# Altium schematic sheet Boost-Shield-V1.5.SchDoc
size B; SheetNumber: 3; SheetTotal: 3
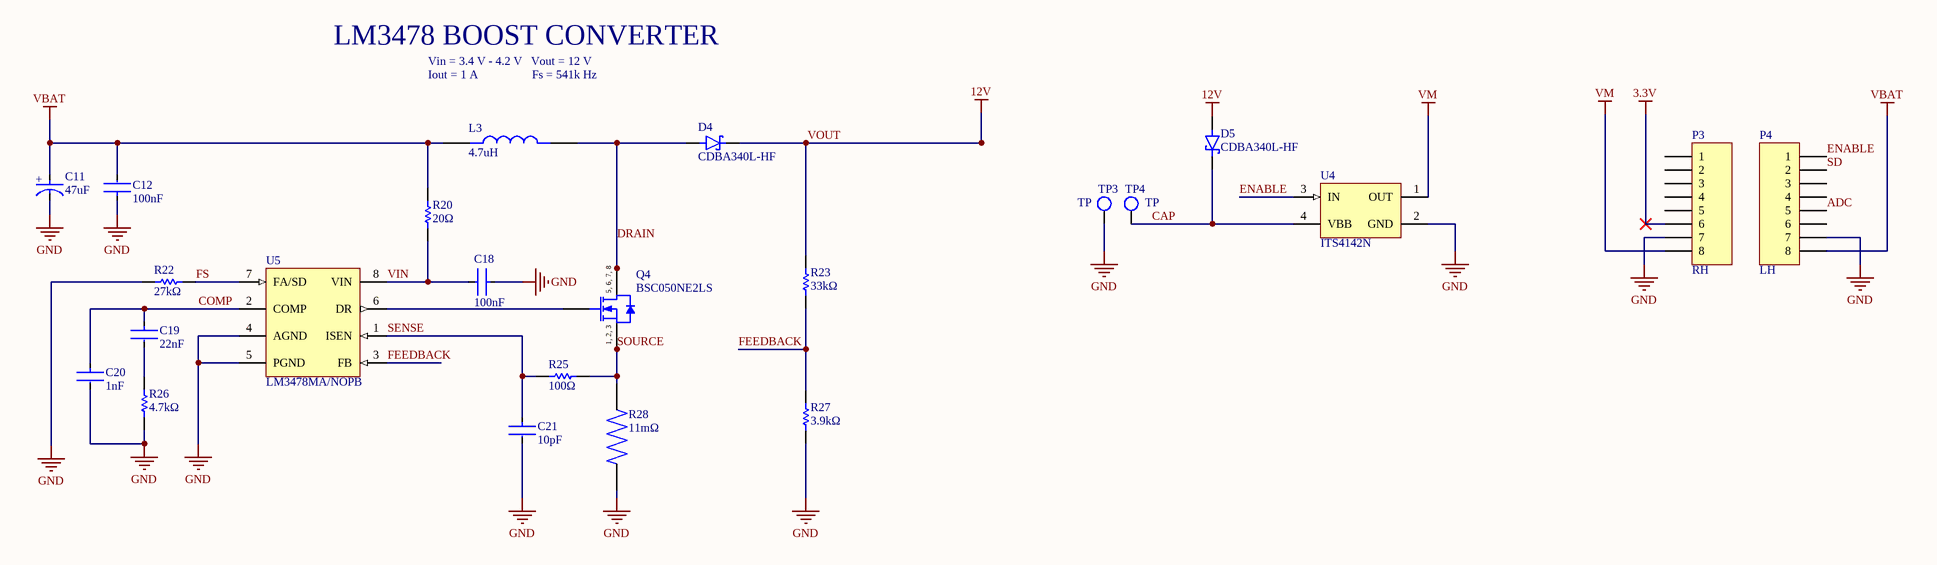
[diagram p0: Boost-Shield-V1.5.SchDoc]

## Parts
C11  47uF  [FP-F38M-MFG]
C12  100nF  [FP-CL10-IPC_C]
C18  100nF  [FP-CL10-IPC_C]
C19  22nF  [FP-CC0603-DA-MFG]
C20  1nF  [FP-0603-L_1_6_0_15-W_0_81-IPC_C]
C21  10pF  [FP-C0603C-CF-MFG]
D4  CDBA340L-HF  [DIOM5225X250N]
D5  CDBA340L-HF  [DIOM5225X250N]
L3  4.7uH  [IND_ETQP4M4R7KFN]
P3  RH  [HDR1X8]
P4  LH  [HDR1X8]
Q4  BSC050NE2LS  [INF-PG-TDSON-8-1_V]
R20  20Ω  [RESC1608X55X30ML15T15]
R22  27kΩ  [RESC1608X55X30ML15T15]
R23  33kΩ  [RESC1609X50X30LL10T20]
R25  100Ω  [RESC1609X50X30ML8T20]
R26  4.7kΩ  [RESC1608X55X30NL15T15]
R27  3.9kΩ  [RESC1608X55X30LL15T15]
R28  11mΩ  [RESC3115X65N]
TP3  TP  [TP]
TP4  TP  [TP]
U4  ITS4142N  [INF-SOT223_M]
U5  LM3478MA/NOPB  [D0008A_L]

## Nets
3.3V: P3.6
GND: C11.1(C) C12.1 C18.1 C20.2 C21.2 P3.7 P4.7 R22.1 R26.1 R27.1 R28.1 TP3.1 U4.2(GND) U5.4(AGND) U5.5(PGND)
VBAT: C11.2(A) C12.2 L3.1 P4.8 R20.2
VM: P3.8 U4.1(OUT)
VOUT: D4.C(K) D5.A R23.2  [also labelled 12V]
ADC: P4.5
CAP: D5.C(K) TP4.1 U4.4(VBB)
COMP: C19.1 C20.1 U5.2(COMP)
DRAIN: D4.A L3.2 Q4.5(DRAIN) Q4.6(DRAIN) Q4.7(DRAIN) Q4.8(DRAIN)
ENABLE: P4.1 U4.3(IN)
FEEDBACK: R23.1 R27.2 U5.3(FB)
FS: R22.2 U5.7(FA/SD)
SD: P4.2
SENSE: C21.1 R25.1 U5.1(ISEN)
SOURCE: Q4.1(SOURCE) Q4.2(SOURCE) Q4.3(SOURCE) R25.2 R28.2
VIN: C18.2 R20.1 U5.8(VIN)
NetC19_2: C19.2 R26.2
NetQ4_4: Q4.4(GATE) U5.6(DR)

Not connected (* = marked no-connect by the designer): P3 1 2 3 4 5; P4 3 4 6

## Notes on the sheet
- LM3478 BOOST CONVERTER
- Vin = 3.4 V - 4.2 V   Vout = 12 V
  Iout = 1 A                  Fs = 541k Hz
- (in symbol CMP-1090-00044-1) 5, 6, 7, 8; 1, 2, 3
- (in symbol CMP-04423-000016-1) +

## Library data of the parts
C11 = CMP-04423-000016-1: CAP TANT POLY 47UF 6.3V SMD / F380J476MMAAXEH3; Manufacturer: AVX; Dissipation Factor: 10%; Ripple Current: 289mA; Life: 1000Hours; Leakage Current: 59.2uA; Esr: 300mΩ; Material: Tantalum-Polymer; Tolerance: 20%; ComponentLink2Description: Datasheet; Device Class L2: Capacitors; Temperature Range Low: -55°C; Device Class L1: Passive Components; Voltage Rating: 6.3V; Device Class L3: Polymer Capacitors; Automotive: No; Temperature: -55°C to +105°C; Lead Free: Yes; Height: 1mm; Digikey Description: CAP TANT POLY 47UF 6.3V SMD; ComponentLink2URL: http://datasheets.avx.com/F38.pdf; Package: F38M; RoHS: TRUE; Capacitance: 47uF; Octopart: https://octopart.com/f380j476mmaaxeh3-avx-67040374; Manufacturer Part Number: F380J476MMAAXEH3; Value: 47uF; Footprint Url: http://www.avx.com/download/software/literature/AVX-Footprint-Library.pdf; Temperature Range High: +105°C; Category: Cap
C12 C18 = CMP-13271-001724-1: Cap Ceramic 100nF 50V X7R ±20% Pad SMD 0603 +125°C T/R / CL10B104MB8NNNC; Mount: Surface Mount; Lead Free: Lead Free; Max Operating Temperature: 125°C; Voltage Rating: 50V; Case Code (Imperial): 0603; Capacitance: 100nF; Height: 0.8mm; Length: 1.6mm; Tolerance: 20%; Case Code (Metric): 1608; Thickness: 0.035inch; Depth: 0.8mm; Width: 0.031inch; Package Quantity: 1; Min Operating Temperature: -55°C; Case/Package: 0603; Radiation Hardening: No; Voltage Rating (DC): 50V; Dielectric: X7R; Packaging: Tape and Reel
C19 = CMP-2100-03602-2: 0603 22 nF 50 V ±10 % Tolerance X7R SMT Multilayer Ceramic Capacitor / CC0603KRX7R9BB223; Manufacturer: YAGEO; Temperature Coefficient: 15%; Tolerance: 0.1; Voltage Rating: 50 V; Device Class L3: Ceramic Capacitors; Temperature Range Low: -55°C; RoHS: TRUE; Temperature Range High: +125°C; Category: Cap; Capacitance: 22 nF; Height: 0.9mm; Manufacturer Part Number: CC0603KRX7R9BB223; ComponentLink2Description: Datasheet; Value: 22 nF; ComponentLink2URL: http://www.yageo.com/documents/recent/UPY-GPHC_X7R_6.3V-to-50V_18.pdf; Material: Ceramic; Digikey Description: 0603 22 nF 50 V ±10 % Tolerance X7R SMT Multilayer Ceramic Capacitor; Device Class L1: Passive Components; Device Class L2: Capacitors; Temperature Characteristic: X7R; Octopart: https://octopart.com/cc0603krx7r9bb223-yageo-41224721; Automotive: No; Temperature: -55°C to +125°C; Lead Free: Yes; Package: CC0603-DA; Mouser Description: Multilayer Ceramic Capacitors MLCC - SMD/SMT 22nF 50V X7R 10%; Footprint Url: http://www.yageo.com/exep/pages/download/literatures/UPY-C_GEN_24.pdf; Voltage: 50 V
C20 = CMP-2006-02076-2: CAP CER 10000PF 50V X7R 0603 / 06035C103KAT4A; Insulation Resistance: 100GR; Tolerance: 10%; Dissipation Factor: 2.5%; Capacitance: 10nF; Number of Pins: 2; Package Quantity: 15000; Voltage Rating (DC): 50V; Case Code (Imperial): 0603; Series: -; Depth: 0.81mm; Termination: SMD/SMT; Packaging: Tape and Reel; Length: 1.6mm; Radiation Hardening: No; REACH SVHC: No SVHC; Height: 0.9mm; Min Operating Temperature: -55°C; Voltage Rating: 50V; RoHS Compliant: Yes; Case Code (Metric): 1608; Width: 0.81mm; Lead Free: Lead Free; Construction: Flat; Case/Package: 0603; Voltage: 50V; Dielectric: X7R; Max Operating Temperature: 125°C; Mount: Surface Mount
C21 = CMP-2006-03324-2: CAP CER 10PF 100V 5% NP0 0603 / C0603C100J1GACTU; Manufacturer: KEMET; Temperature Coefficient: 30ppm/°C; Automotive Grade: Grade 1; Material: Ceramic; Tolerance: 0.05; Temperature Characteristic: C0G; Temperature: -55°C to +125°C; Manufacturer Part Number: C0603C100J1GACTU; Voltage Rating: 100 V; ComponentLink2Description: Datasheet; Octopart: https://octopart.com/c0603c100j1gactu-kemet-109684; Mouser Description: Multilayer Ceramic Capacitors MLCC - SMD/SMT 100volts 10pF C0G 5%; Automotive: Yes; Digikey Description: CAP CER 10PF 100V 5% NP0 0603; Device Class L2: Capacitors; Lead Free: Yes; Height: 0.87mm; ComponentLink2URL: https://api.kemet.com/component-edge/download/datasheet/C0603C100J5GACAUTO.pdf; Value: 10 pF; Temperature Range High: +125°C; Package: C0603C-CF; Temperature Range Low: -55°C; RoHS: TRUE; Device Class L1: Passive Components; Category: Cap; Capacitance: 10 pF; Device Class L3: Ceramic Capacitors
D4 D5 = CDBA340L-HF: DIODE SCHOTTKY 40V 3A DO214AC; Manufacturer: Comchip; Supplier 1: Digi-Key; Manufacturer Part Number: CDBA340L-HF; RoHS: Yes; Category: Rectifier Diodes; Stock 1: 46445; Pricing 1: 1=0.60000, 10=0.53100, 100=0.40730, 500=0.32200, 1000=0.25760, 2000=0.23345 (USD); Mount: Surface Mount; Package Quantity: 5000; Packaging: Cut Tape; Average Rectified Current: 3A; Max Reverse Voltage (DC): 40V; Series: -; RoHS Compliant: Yes; ComponentLink1URL: https://datasheet.ciiva.com/6377/cdba340l-hfrevc514368-6377916.pdf?src-supplier=Digi-Key; ComponentLink1Description: https://datasheet.ciiva.com/6377/cdba340l-hfrevc514368-6377916.pdf?src-supplier=Digi-Key; Supplier Part Number 1: 641-1702-1-ND
L3 = ETQ-P4M4R7KFN: Fixed Ind 4.7UH 7.3A 22.77MOHM; Manufacturer: Panasonic; Supplier 1: Digi-Key; Manufacturer Part Number: ETQ-P4M4R7KFN; RoHS: No; Category: Fixed Inductors; Stock 1: 1000; Pricing 1: 1=1.10000, 10=1.02600, 25=0.94720, 50=0.78920, 100=0.74190, 250=0.66296 (USD); Supplier Part Number 1: P124174CT-ND
P3 P4 = Header 8: Header, 8-Pin; LatestRevisionDate: 17-Jul-2002; LatestRevisionNote: Re-released for DXP Platform.; Publisher: Altium Limited
Q4 = CMP-1090-00044-1: N-Channel OptiMOS Power-MOSFET, 25 V VDS, 58 A ID, -55 to 150 degC, PG-TDSON-8-1, Reel, Green; Manufacturer: Infineon; RthJA (max): 50Â K/W; Polarity: N; RthJC (max): 4.5Â K/W; RDS (on) (max): 5Â mOhm; Ptot (max): 28Â W; RDS (on) (max) (@4.5V): 7.1Â mOhm; ID (max): 58Â A; VGS(th) (min): 1.2Â V; VDS (max): 25Â V; QG: 5Â nC; Green: TRUE; IDpuls (max): 232Â A; VGS(th) (max): 2Â V; ComponentLink3Description: Package Specification; ComponentLink2URL: http://www.infineon.com/dgdl/BSC050NE2LS_Rev+2.1_.pdf?folderId=db3a304326dfb1300126fb3bec803f1a&fileId=db3a304326dfb1300126fb5ce0cb3f2d; ComponentLink1Description: Manufacturer URL; Rth: 4.5Â K/W; ComponentLink3URL: http://www.infineon.com/cms/packages/SMD_-_Surface_Mounted_Devices/P-PG-TDSON/P-PG-TDSON-08-01x_2x_3.html?__locale=en; PackageReference: PG-TDSON-8-1; PartNumber: BSC050NE2LS; PackageDescription: 8-Pin Plastic (Green) Thin Dual Small Outline Non-Leaded Package, 5.15 x 5.9 mm Body, 1.27 mm Pitch; DatasheetVersion: Rev. 2.1; Packing: Reel; Mounting Technology: Surface Mount; ComponentLink1URL: http://www.infineon.com/; ComponentLink2Description: Datasheet; Halogen-free: TRUE
R20 = CMP-2000-00739-1: ERJ-3GEYJ200V; Manufacturer: Panasonic; Part Number: ERJ-3GEYJ200V
R22 = CMP-2000-00390-1: ERJ3EKF2702V; Manufacturer: Panasonic; Part Number: ERJ3EKF2702V
R23 = CMP-2000-03246-1: CRCW060333K0JNEA; Manufacturer: Vishay Dale; Part Number: CRCW060333K0JNEA
R25 = CMP-2000-03824-5: Chip Resistor, 100 Ohm, +/- 1%, 100 mW,-55 to 155 degC, 0603 (1608 Metric), RoHS, Tape and Ree / CRCW0603100RFKEA; Manufacturer: Vishay Semiconductor; ComponentLink2URL: http://www.vishay.com/docs/20035/dcrcwe3.pdf; ComponentLink1URL: http://www.vishay.com/; Mounting Technology: Surface Mount; ComponentLink1Description: Manufacturer URL; ComponentLink2Description: Datasheet; PackageDescription: 2-Pin Surface Mount Device, Body 1.575 x 0.85 mm; PackageReference: 0603; DatasheetVersion: 06/2012
R26 = CMP-1012-00586-3: Precision Thick Film Chip Resistor, 4.7 KOhm, +/- 1%, -55 to 155 degC, 0603 (1608 Metric), RoHS, Tape and Reel / ERJ-3EKF4701V; Resistance: 220 Ohm; Voltage Rating: 50 V; Elements: 4; Case\Package: 1205; Tolerance: 5%; Power Rating: 250 mW; PackageReference: 0603; Max Operating Temperature: 125 degC; REACH SVHC: No SVHC; Width: 0.063 inch; Length: 0.126 inch; Height: 0.024 inch; Mount: Surface Mount; Package Quantity: 1; DatasheetVersion: Apr-15; ComponentLink1Description: Manufacturer URL; Min Operating Temperature: -55 degC; Packaging: Tape and Reel; Radiation Hardening: No; ComponentLink2URL: http://industrial.panasonic.com/cdbs/www-data/pdf/RDA0000/AOA0000C86.pdf; Case Code (Metric): 3216; Pins: 8; Case Code (Imperial): 1206; Type (Resistor): Thick Film; RoHSCompliant: true; ComponentLink2Description: Datasheet; PackageDescription: 2-Pin Surface Mount Device, Body 1.6 x 0.85 mm; ComponentLink1URL: http://www.panasonic.com/
R27 = CMP-2000-00783-1: ERJ-3GEYJ392V; Manufacturer: Panasonic; Part Number: ERJ-3GEYJ392V
R28 = RLP73V2BR011FTDF: 11 mOhms ±1% 0.5W, 1/2W Chip Resistor 1206 (3216 Metric) Current Sense Thick Film
U4 = CMP-1095-00140-1: Smart High-Side Power Switch for Industrial Applications 1 Channel: 1 x 200 mOhm, 12 to 45 V Operating, -30 to 85 degC, SOT223, Reel, Green; Manufacturer: Infineon; IL (nom)min - all channels active: 1.4Â A; RON @ 25 degC: 200 mOhm (max); RON (max) @ Tj max: 320 mOhm; Operating Voltage Range (max): 45 V; IL (SCp): 4.5Â A; toff (max): 150 us; Green: TRUE; IL (SC): 3 A; Operating Voltage Range (min): 12 V; Ptot (max): 1.4Â W; Channels: 1; ton (max): 100 us; PackageDescription: 4-Pin Small Outline Transistor Package, 6.5 x 3.5 mm Body, 2.3 mm Pitch; PartNumber: ITS4142N; ComponentLink2Description: Datasheet; PackageReference: SOT223; Mounting Technology: Surface Mount; PackageVersion: Apr-08; Packing: Reel; ComponentLink1Description: Manufacturer URL; Load Current (typ): 1.4Â A; ComponentLink3Description: Package Specification; ComponentLink1URL: http://www.infineon.com/; IL (nom)min - one channel active: 1.4Â A; ComponentLink3URL: http://www.infineon.com/dgdl/SOT223-Package_Overview.pdf?folderId=db3a30431936bc4b0119530470b03c3d&fileId=db3a30431936bc4b0119531d40b93c5c; ComponentLink2URL: http://www.infineon.com/dgdl/ITS4142N_20060309.pdf?folderId=db3a304412b407950112b408e8c90004&fileId=db3a304412b407950112b4296b0840e1
U5 = CMP-0063-01437-3: High Efficiency Low-Side N-Channel Controller for Switching Regulator, 8-pin Narrow SOIC, 1000 Reel; Manufacturer: Texas Instruments; CompType: MiscPower; PackageTopMarking: NSZXTT*L3478*MA; High-Reliability: Y; PowerWise: N; ComponentLink1URL: http://www.ti.com/general/docs/lit/getliterature.tsp?genericPartNumber=LM3478&fileType=pdf; PinCount: 8; PartNumber: LM3478MA/NOPB; PackageDescription: SOIC Narrow, 4.9 x 3.9 x 1.45mm, 8 Lead, 1.27mm Pitch; PackageReference: D0008A; Code_IPC: SOIC127P600-8; RoHS: Y; Code_JEDEC: MS-012-AA; ComponentLink1Description: Datasheet URL